# Altium schematic sheet BUS.SchDoc
size A4; SheetNumber: 3; SheetTotal: 6
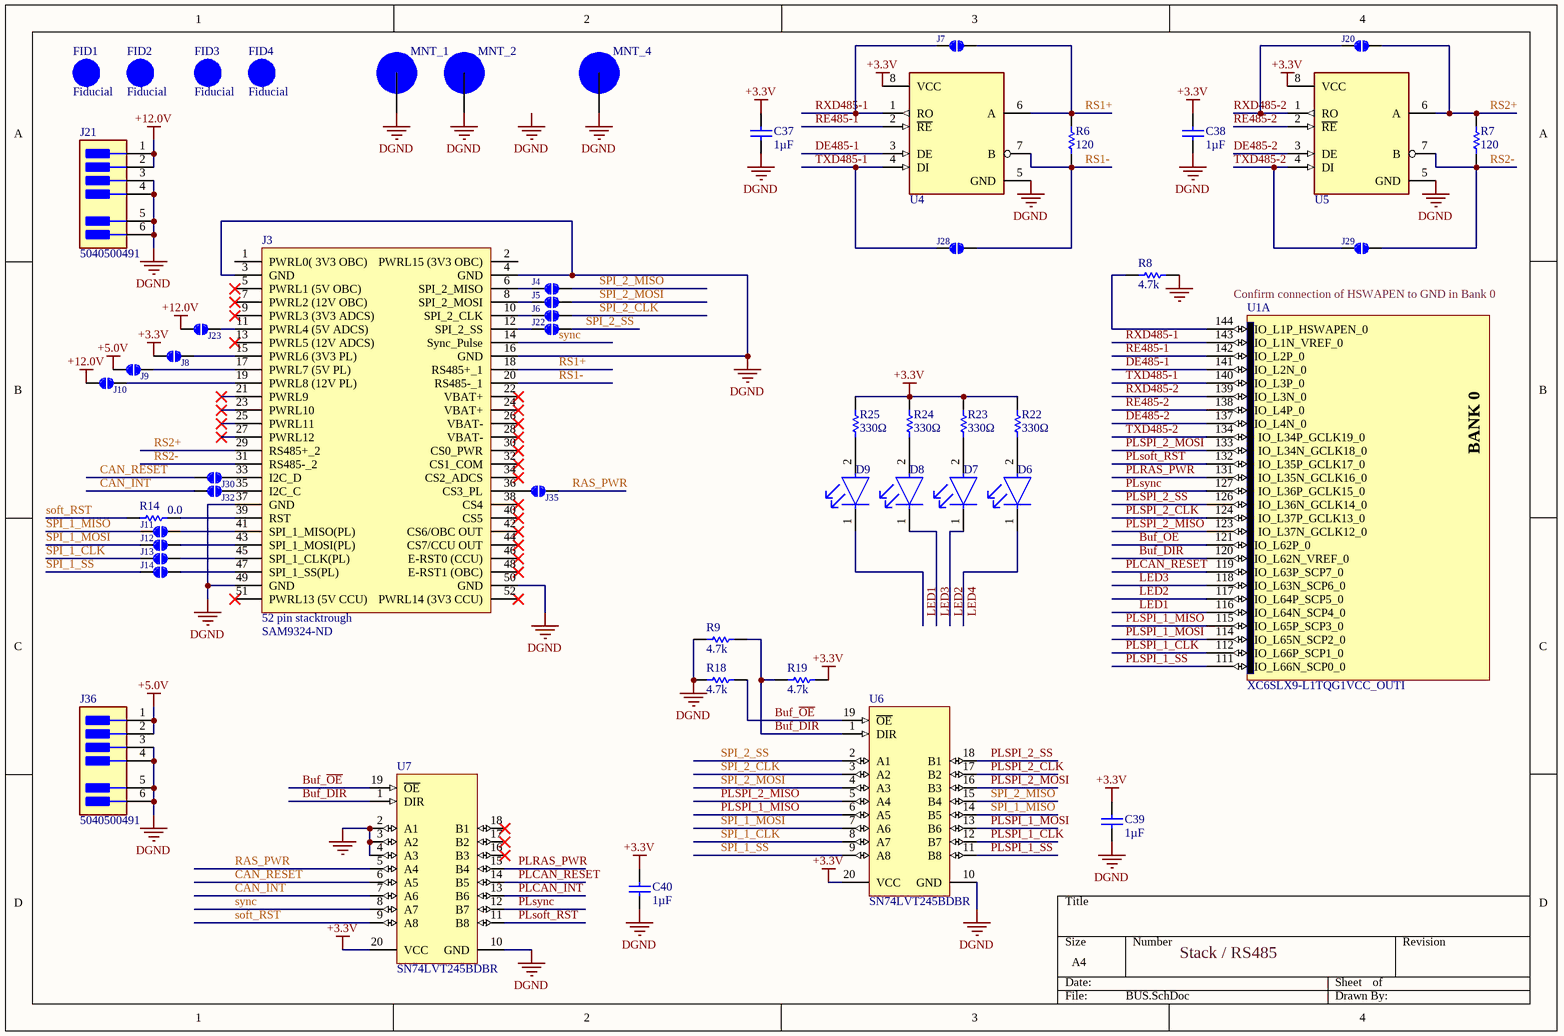
[diagram p0: BUS.SchDoc]

## Parts
C37  Capacitance: 1µF  [0603CAP]  (hidden comment: Cap_CER_1U_10V_0603)
C38  Capacitance: 1µF  [0603CAP]  (hidden comment: Cap_CER_1U_10V_0603)
C39  Capacitance: 1µF  [0603CAP]  (hidden comment: Cap_CER_1U_10V_0603)
C40  Capacitance: 1µF  [0603CAP]  (hidden comment: Cap_CER_1U_10V_0603)
D6  LED RED CLEAR 2SMD  [ROHM_SML-21_MFG]  (value not drawn)
D7  LED RED CLEAR 2SMD  [ROHM_SML-21_MFG]  (value not drawn)
D8  LED RED CLEAR 2SMD  [ROHM_SML-21_MFG]  (value not drawn)
D9  LED RED CLEAR 2SMD  [ROHM_SML-21_MFG]  (value not drawn)
FID1  Fiducial  [FID]  (no BOM)
FID2  Fiducial  [FID]  (no BOM)
FID3  Fiducial  [FID]  (no BOM)
FID4  Fiducial  [FID]  (no BOM)
J3  52 pin stacktrough  Supplier Part Number 1: SAM9324-ND  [StackThrough52]
J4  JUMPER  [SJMP]  (value not drawn)
J5  JUMPER  [SJMP]  (value not drawn)
J6  JUMPER  [SJMP]  (value not drawn)
J7  JUMPER  [SJMP]  (value not drawn)
J8  JUMPER  [SJMP]  (value not drawn)
J9  JUMPER  [SJMP]  (value not drawn)
J10  JUMPER  [SJMP]  (value not drawn)
J11  JUMPER  [SJMP]  (value not drawn)
J12  JUMPER  [SJMP]  (value not drawn)
J13  JUMPER  [SJMP]  (value not drawn)
J14  JUMPER  [SJMP]  (value not drawn)
J20  JUMPER  [SJMP]  (value not drawn)
J21  5040500491  [MOLEX_5040500491]
J22  JUMPER  [SJMP]  (value not drawn)
J23  JUMPER  [SJMP]  (value not drawn)
J28  JUMPER  [SJMP]  (value not drawn)
J29  JUMPER  [SJMP]  (value not drawn)
J30  JUMPER  [SJMP]  (value not drawn)
J32  JUMPER  [SJMP]  (value not drawn)
J35  JUMPER  [SJMP]  (value not drawn)
J36  5040500491  [MOLEX_5040500491]
MNT_1  Mount Hole  [Mount_Hole]  (value not drawn)  (no BOM)
MNT_2  Mount Hole  [Mount_Hole]  (value not drawn)  (no BOM)
MNT_4  Mount Hole  [Mount_Hole]  (value not drawn)  (no BOM)
R6  Resistance (Ohms): 120  [0603RES]  (hidden comment: RES_120_0.25W_0603)
R7  Resistance (Ohms): 120  [0603RES]  (hidden comment: RES_120_0.25W_0603)
R8  Resistance (Ohms): 4.7k  [0603RES]  (hidden comment: RES_4.7K_0.1W_0603)
R9  Resistance (Ohms): 4.7k  [0603RES]  (hidden comment: RES_4.7K_0.1W_0603)
R14  Resistance (Ohms): 0.0  [0603RES]  (hidden comment: RES_0_0.1W_0603)
R18  Resistance (Ohms): 4.7k  [0603RES]  (hidden comment: RES_4.7K_0.1W_0603)
R19  Resistance (Ohms): 4.7k  [0603RES]  (hidden comment: RES_4.7K_0.1W_0603)
R22  Resistance: 330Ω  [0603]  (hidden comment: RES_330 Ohm_0603)
R23  Resistance: 330Ω  [0603]  (hidden comment: RES_330 Ohm_0603)
R24  Resistance: 330Ω  [0603]  (hidden comment: RES_330 Ohm_0603)
R25  Resistance: 330Ω  [0603]  (hidden comment: RES_330 Ohm_0603)
U1  XC6SLX9-L1TQG1VCC_OUTI  [TQG144_M]  (part A of 7)
U4  ADM3493ARZ  [Soic8_IPCA]  (value not drawn)
U5  ADM3493ARZ  [Soic8_IPCA]  (value not drawn)
U6  SN74LVT245BDBR  [DB0020A_M]
U7  SN74LVT245BDBR  [DB0020A_M]

## Nets
+3.3V: C37.2 C38.2 C39.2 C40.2 J8.1 R19.1 R22.2 R23.2 R24.2 R25.2 U4.8(VCC) U5.8(VCC) U6.20(VCC) U7.20(VCC)
+5.0V: J9.1 J36.1 J36.2
+12.0V: J10.1 J21.1 J21.2 J23.1
DGND: C37.1 C38.1 C39.1 C40.1 J3.3(GND) J3.4(GND) J3.16(GND) J3.37(GND) J3.49(GND) J3.50(GND) J21.3 J21.4 J21.5 J21.6 J36.3 J36.4 J36.5 J36.6 MNT_1.1 MNT_2.1 MNT_4.1 R8.2 R9.2 R18.2 U4.5(GND) U5.5(GND) U6.10(GND) U7.2(A1) U7.3(A2) U7.4(A3) U7.10(GND)
Buf_DIR: R9.1 R19.2 U1.120(IO_L62N_VREF_0) U6.1(DIR) U7.1(DIR)
Buf_~{OE}: R18.1 U1.121(IO_L62P_0) U6.19(~{OE}) U7.19(~{OE})
CAN_INT: J32.1 U7.7(A6)
CAN_RESET: J30.1 U7.6(A5)
DE485-1: U1.141(IO_L2N_0) U4.3(DE)
DE485-2: U1.137(IO_L4N_0) U5.3(DE)
LED1: D9.1(C) U1.116(IO_L64N_SCP4_0)
LED2: D7.1(C) U1.117(IO_L64P_SCP5_0)
LED3: D8.1(C) U1.118(IO_L63N_SCP6_0)
LED4: D6.1(C)
PLCAN_INT: U7.13(B6)
PLCAN_RESET: U1.119(IO_L63P_SCP7_0) U7.14(B5)
PLRAS_PWR: U1.131(IO_L35N_GCLK16_0) U7.15(B4)
PLsoft_RST: U1.132(IO_L35P_GCLK17_0) U7.11(B8)
PLSPI_1_CLK: U1.112(IO_L66P_SCP1_0) U6.12(B7)
PLSPI_1_MISO: U1.115(IO_L65P_SCP3_0) U6.6(A5)
PLSPI_1_MOSI: U1.114(IO_L65N_SCP2_0) U6.13(B6)
PLSPI_1_SS: U1.111(IO_L66N_SCP0_0) U6.11(B8)
PLSPI_2_CLK: U1.124(IO_L37P_GCLK13_0) U6.17(B2)
PLSPI_2_MISO: U1.123(IO_L37N_GCLK12_0) U6.5(A4)
PLSPI_2_MOSI: U1.133(IO_L34N_GCLK18_0) U6.16(B3)
PLSPI_2_SS: U1.126(IO_L36N_GCLK14_0) U6.18(B1)
PLsync: U1.127(IO_L36P_GCLK15_0) U7.12(B7)
~{RE}485-1: U1.142(IO_L2P_0) U4.2(~{RE})
~{RE}485-2: U1.138(IO_L4P_0) U5.2(~{RE})
RAS_PWR: J35.2 U7.5(A4)
RS1+: J3.18(RS485+_1) J7.2 R6.2 U4.6(A)
RS1-: J3.20(RS485-_1) J28.2 R6.1 U4.7(B)
RS2+: J3.29(RS485+_2) J20.2 R7.2 U5.6(A)
RS2-: J3.31(RS485-_2) J29.2 R7.1 U5.7(B)
RXD485-1: J7.1 U1.143(IO_L1N_VREF_0) U4.1(RO)
RXD485-2: J20.1 U1.139(IO_L3N_0) U5.1(RO)
soft_RST: R14.1 U7.9(A8)
SPI_1_CLK: J13.1 U6.8(A7)
SPI_1_MISO: J11.1 U6.14(B5)
SPI_1_MOSI: J12.1 U6.7(A6)
SPI_1_SS: J14.1 U6.9(A8)
SPI_2_CLK: J6.2 U6.3(A2)
SPI_2_MISO: J4.2 U6.15(B4)
SPI_2_MOSI: J5.2 U6.4(A3)
SPI_2_SS: J22.2 U6.2(A1)
sync: J3.14(Sync_Pulse) U7.8(A7)
TXD485-1: J28.1 U1.140(IO_L3P_0) U4.4(DI)
TXD485-2: J29.1 U1.134(IO_L34P_GCLK19_0) U5.4(DI)
NetD6_2: D6.2(A) R22.1
NetD7_2: D7.2(A) R23.1
NetD8_2: D8.2(A) R24.1
NetD9_2: D9.2(A) R25.1
NetJ3_6: J3.6(SPI_2_MISO) J4.1
NetJ3_8: J3.8(SPI_2_MOSI) J5.1
NetJ3_10: J3.10(SPI_2_CLK) J6.1
NetJ3_11: J3.11(PWRL4_(5V_ADCS)) J23.2
NetJ3_12: J3.12(SPI_2_SS) J22.1
NetJ3_15: J3.15(PWRL6_(3V3_PL)) J8.2
NetJ3_17: J3.17(PWRL7_(5V_PL)) J9.2
NetJ3_19: J3.19(PWRL8_(12V_PL)) J10.2
NetJ3_33: J3.33(I2C_D) J30.2
NetJ3_35: J3.35(I2C_C) J32.2
NetJ3_36: J3.36(CS3_PL) J35.1
NetJ3_39: J3.39(RST) R14.2
NetJ3_41: J3.41(SPI_1_MISO(PL)) J11.2
NetJ3_43: J3.43(SPI_1_MOSI(PL)) J12.2
NetJ3_45: J3.45(SPI_1_CLK(PL)) J13.2
NetJ3_47: J3.47(SPI_1_SS(PL)) J14.2
NetR8_1: R8.1 U1.144(IO_L1P_HSWAPEN_0)

Not connected (* = marked no-connect by the designer): J3 1(PWRL0(_3V3_OBC)) 2(PWRL15_(3V3_OBC)) 5(PWRL1_(5V_OBC))* 7(PWRL2_(12V_OBC))* 9(PWRL3_(3V3_ADCS))* 13(PWRL5_(12V_ADCS))* 21(PWRL9)* 22(VBAT+)* 23(PWRL10)* 24(VBAT+)* 25(PWRL11)* 26(VBAT-)* 27(PWRL12)* 28(VBAT-)* 30(CS0_PWR)* 32(CS1_COM)* 34(CS2_ADCS)* 38(CS4)* 40(CS5)* 42(CS6/OBC_OUT)* 44(CS7/CCU_OUT)* 46(E-RST0_(CCU))* 48(E-RST1_(OBC))* 51(PWRL13_(5V_CCU))* 52(PWRL14_(3V3_CCU))*; U7 16(B3)* 17(B2)* 18(B1)*

## Notes on the sheet
- Confirm connection of HSWAPEN to GND in Bank 0
- Stack / RS485
- Labels drawn without touching a wire or pin: DGND
- (in symbol XC6SLX9-L1TQG144I, part A) BANK 0

## Library data of the parts
C37-C40 = Cap_CER_1U_10V_0603: Capacitor; Manufacturer: Taiyo Yuden; Manufacturer Part Number: LMK107B7105KA-T; Tolerance: ±10%; Voltage - Rated: 10V; Temperature Coefficient: X7R; Supplier 1: Digi-Key; RoHS: RoHS Compliant; Category: Capacitors; Stock 1: 600713; Pricing 1: 1=0.1, 10=0.042, 25=0.0308, 50=0.023, 100=0.0188, 250=0.01576, 500=0.01344, 1000=0.01056 (USD); Packaging: Cut Tape (CT); Part Status: Active; Operating Temperature: -55°C ~ 125°C; Features: -; Ratings: -; Applications: General Purpose; Mounting Type: Surface Mount, MLCC; Package / Case: 0603 (1608 Metric); Size / Dimension: 0.063" L x 0.031" W (1.60mm x 0.80mm); Height - Seated (Max): -; Thickness (Max): 0.035" (0.90mm); Lead Spacing: -; Lead Style: -; ComponentLink1URL: http://ds.yuden.co.jp/TYCOMPAS/ut/detail.do?productNo=LMK107B7105KA-T&fileName=LMK107B7105KA-T_SS&mode=specSheetDownload; ComponentLink1Description: http://ds.yuden.co.jp/TYCOMPAS/ut/detail.do?productNo=LMK107B7105KA-T&fileName=LMK107B7105KA-T_SS&mode=specSheetDownload; Supplier Part Number 1: 587-1242-1-ND
D6-D9 = APT2012LSECK/J3-PRV: Red 625nm LED Indication - Discrete 1.8V 0805 (2012 Metric); Manufacturer: Kingbright; Lens Color: Colorless; Luminous Intensity: 40mcd; Test Current: 2mA; Viewing Angle: 120°; Supplier 1: Digi-Key; Manufacturer Part Number: APT2012LSECK/J3-PRV; RoHS: Yes; Category: LEDs; Stock 1: 47256; Pricing 1: 1=0.68000, 10=0.41600, 100=0.23890, 1000=0.18698 (USD); Mount: Surface Mount; Case/Package: 0805; Color: Red; Case Code (Metric): 2012; Case Code (Imperial): 0805; Packaging: Tape and Reel; Lens Transparency: Clear; Dominant Wavelength: 625nm; Forward Voltage: 1.8V; Length: 2mm; Width: 1.25mm; Height: 0.75mm; RoHS Compliant: Yes; ComponentLink1URL: http://www.mouser.com/ds/2/216/APT2012LSECK-J3-PRV-535674.pdf?src-supplier=Mouser; ComponentLink1Description: http://www.mouser.com/ds/2/216/APT2012LSECK-J3-PRV-535674.pdf?src-supplier=Mouser; ComponentLink2URL: http://www.kingbrightusa.com/images/catalog/SPEC/APT2012LSECK-J3-PRV.pdf?src-supplier=Digi-Key; ComponentLink2Description: http://www.kingbrightusa.com/images/catalog/SPEC/APT2012LSECK-J3-PRV.pdf?src-supplier=Digi-Key; Supplier Part Number 1: 754-1935-1-ND
J3 = SPNEX_BUS: Conn Elevated Socket SKT 52 POS 2.54mm Solder ST Top Entry Thru-Hole Tube; Manufacturer: Samtec; Manufacturer Part Number: ESQ-126-38-G-D; Number of Contacts: 52; Gender: Female; Supplier 1: Digi-Key; RoHS: Yes; Category: Headers and Wire Housings; Stock 1: 81; Pricing 1: 1=17.62000, 16=15.26875, 80=12.58425, 440=11.49361 (USD); Mount: Through Hole; Contact Plating: Gold; Termination: Solder; Number of Rows: 2; Packaging: Bulk; Pitch: 2.54mm; Radiation Hardening: No; ComponentLink1URL: http://cloud.samtec.com/catalog_english/ESW_TH.PDF?src-supplier=Avnet; ComponentLink1Description: http://cloud.samtec.com/catalog_english/ESW_TH.PDF?src-supplier=Avnet; ComponentLink2URL: http://suddendocs.samtec.com/prints/esq-1xx-xx-x-x-xxx-xx-x-xx-mkt.pdf?src-supplier=Digi-Key; ComponentLink2Description: http://suddendocs.samtec.com/prints/esq-1xx-xx-x-x-xxx-xx-x-xx-mkt.pdf?src-supplier=Digi-Key
J4-J14 J20 J22 J23 J28-J30 J32 J35 = JUMPER: OPTION SELECTION PAD; Supplier 1: Digi-Key
J21 J36 = 5040500491: Connector Header Surface Mount, Right Angle 4 position 0.059" (1.50mm); Manufacturer: Molex; Supplier 1: Digi-Key; Manufacturer Part Number: 5040500491; RoHS: Yes; Category: Headers and Wire Housings; Stock 1: 197190; Pricing 1: 1=0.78000, 10=0.64700, 100=0.53880 (USD); ComponentLink1URL: https://datasheet.ciiva.com/48768/0532610471-pcb-headers-48768287.pdf?src-supplier=Avnet; ComponentLink1Description: https://datasheet.ciiva.com/48768/0532610471-pcb-headers-48768287.pdf?src-supplier=Avnet; Supplier Part Number 1: WM10137CT-ND
MNT_1 MNT_2 MNT_4 = MNT_Hole
R6 R7 = RES_120_0.25W_0603: RES SMD 120 OHM 5% 1/4W 0603; Manufacturer: Rohm Semiconductor; Manufacturer Part Number: ESR03EZPJ121; Power (Watts): 0.25W, 1/4W; Temperature Coefficient: ±200ppm/°C; Supplier 1: Digi-Key; RoHS: RoHS Compliant; Category: Resistors; Stock 1: 32826; Pricing 1: 1=0.1, 10=0.079, 25=0.0544, 50=0.0424, 100=0.0303, 250=0.0236, 500=0.01876, 1000=0.01331 (USD); Packaging: Digi-Reel®; Part Status: Active; Tolerance: ±5%; Composition: Thick Film; Features: Automotive AEC-Q200, Pulse Withstanding; Operating Temperature: -55°C ~ 155°C; Package / Case: 0603 (1608 Metric); Supplier Device Package: 0603; Size / Dimension: 0.063" L x 0.031" W (1.60mm x 0.80mm); Height - Seated (Max): 0.022" (0.55mm); Number of Terminations: 2; Failure Rate: -; ComponentLink1URL: http://rohmfs.rohm.com/en/products/databook/datasheet/passive/resistor/chip_resistor/esr.pdf; ComponentLink1Description: http://rohmfs.rohm.com/en/products/databook/datasheet/passive/resistor/chip_resistor/esr.pdf; Supplier Part Number 1: RHM120DDKR-ND
R8 R9 R18 R19 = RES_4.7K_0.1W_0603: Resistor; Manufacturer: Stackpole Electronics Inc.; Manufacturer Part Number: RMCF0603JT4K70; Tolerance: ±5%; Power (Watts): 0.1W, 1/10W; Temperature Coefficient: ±200ppm/°C; Supplier 1: Digi-Key; RoHS: RoHS Compliant; Category: Resistors; Stock 1: 86000; Pricing 1: 1=0.1, 10=0.012, 25=0.0088, 50=0.0066, 100=0.0049, 250=0.00372, 500=0.00298, 1000=0.0022 (USD); Packaging: Cut Tape (CT); Part Status: Active; Composition: Thick Film; Features: Automotive AEC-Q200; Operating Temperature: -55°C ~ 155°C; Package / Case: 0603 (1608 Metric); Supplier Device Package: 0603; Size / Dimension: 0.061" L x 0.031" W (1.55mm x 0.80mm); Height - Seated (Max): 0.022" (0.55mm); Number of Terminations: 2; Failure Rate: -; ComponentLink1URL: https://www.seielect.com/Catalog/SEI-RMCF_RMCP.pdf; ComponentLink1Description: https://www.seielect.com/Catalog/SEI-RMCF_RMCP.pdf; Supplier Part Number 1: RMCF0603JT4K70CT-ND
R14 = RES_0_0.1W_0603: Resistor; Manufacturer: Samsung Electro-Mechanics America, Inc.; Manufacturer Part Number: RC1608J000CS; Tolerance: Jumper; Power (Watts): 0.1W, 1/10W; Supplier 1: Digi-Key; RoHS: RoHS Compliant; Category: Resistors; Stock 1: 498586; Pricing 1: 1=0.1, 10=0.017, 25=0.0124, 50=0.0094, 100=0.0069, 250=0.00528, 500=0.00422, 1000=0.0031 (USD); Packaging: Cut Tape (CT); Part Status: Active; Composition: Thick Film; Features: Moisture Resistant; Temperature Coefficient: -; Operating Temperature: -55°C ~ 155°C; Package / Case: 0603 (1608 Metric); Supplier Device Package: 0603; Size / Dimension: 0.063" L x 0.031" W (1.60mm x 0.80mm); Height - Seated (Max): 0.022" (0.55mm); Number of Terminations: 2; Failure Rate: -; ComponentLink1URL: http://media.digikey.com/pdf/Data%20Sheets/Samsung%20PDFs/RC_Series_ds.pdf; ComponentLink1Description: http://media.digikey.com/pdf/Data%20Sheets/Samsung%20PDFs/RC_Series_ds.pdf; Supplier Part Number 1: 1276-3510-1-ND
R22-R25 = RES_330 Ohm_0603: Res Thick Film 0603 330 Ohm 5% 0.1W(1/10W) +/-200ppm/ßC Pad SMD Automotive T/R; Manufacturer: Panasonic; Manufacturer Part Number: ERJ-3GEYJ331V; Power Rating: 100mW; Voltage Rating: 75V; Temperature Coefficient: 200ppm/°C; Voltage Rating (DC): 50V; Supplier 1: Digi-Key; RoHS: Yes; Stock 1: 2750454; Pricing 1: 1 = 0.10000, 10 = 0.05400, 100 = 0.02190, 1000 = 0.00985, 2500 = 0.00855 (USD); Mount: Surface Mount; Case/Package: 0603; Weight: 7.1E-05oz; Case Code (Metric): 1608; Case Code (Imperial): 0603; Contact Plating: Tin; Min Operating Temperature: -55°C; Max Operating Temperature: 155°C; Tolerance: 5%; Packaging: Tape and Reel; Package Quantity: 1; Composition: Thick Film; Number of Terminations: 2; Termination: SMD/SMT; Military Standard: Not; Max Power Dissipation: 100mW; Features: Automotive AEC-Q200; Length: 1.6mm; Height: 0.45mm; Width: 0.031inch; Depth: 0.8mm; Radiation Hardening: No; REACH SVHC: No SVHC; Lead Free: Lead Free; ComponentLink1URL: https://datasheet.ciiva.com/34303/1988727-34303616.pdf?src-supplier=Jameco; ComponentLink1Description: https://datasheet.ciiva.com/34303/1988727-34303616.pdf?src-supplier=Jameco; ComponentLink2URL: https://datasheet.ciiva.com/11821/0900766b80f806dd-11821444.pdf?src-supplier=RSComponents; ComponentLink2Description: https://datasheet.ciiva.com/11821/0900766b80f806dd-11821444.pdf?src-supplier=RSComponents; ComponentLink3URL: https://datasheet.ciiva.com/9117/aoa0000ce1-9117173.pdf?src-supplier=Avnet; ComponentLink3Description: https://datasheet.ciiva.com/9117/aoa0000ce1-9117173.pdf?src-supplier=Avnet; ComponentLink4URL: https://datasheet.ciiva.com/16767/70255313-16767749.pdf?src-supplier=Allied+Electronics; ComponentLink4Description: https://datasheet.ciiva.com/16767/70255313-16767749.pdf?src-supplier=Allied+Electronics; ComponentLink5URL: https://datasheet.ciiva.com/15159/getdatasheetpartid-29203-15159270.pdf?src-supplier=Verical; ComponentLink5Description: https://datasheet.ciiva.com/15159/getdatasheetpartid-29203-15159270.pdf?src-supplier=Verical; ComponentLink6URL: https://datasheet.ciiva.com/28673/1678796-28673994.pdf?src-supplier=Element14; ComponentLink6Description: https://datasheet.ciiva.com/28673/1678796-28673994.pdf?src-supplier=Element14; ComponentLink7URL: https://datasheet.ciiva.com/6138/1500035-6138716.pdf?src-supplier=Farnell; ComponentLink7Description: https://datasheet.ciiva.com/6138/1500035-6138716.pdf?src-supplier=Farnell; ComponentLink8URL: https://datasheet.ciiva.com/46381/1500035-46381164.pdf?src-supplier=Element14; ComponentLink8Description: https://datasheet.ciiva.com/46381/1500035-46381164.pdf?src-supplier=Element14; ComponentLink9URL: https://datasheet.ciiva.com/16449/aoa0000ce1-16449005.pdf?src-supplier=Future+Electronics; ComponentLink9Description: https://datasheet.ciiva.com/16449/aoa0000ce1-16449005.pdf?src-supplier=Future+Electronics; Supplier Part Number 1: P330GCT-ND
U1 = XC6SLX9-L1TQG144I: Spartan-6 LX 1.0V FPGA, 102 User I/Os, 144-Pin TQFP (0.5mm Pitch), Low Power Version, Industrial Grade, Pb-Free; Published: 17-Nov-2009; DatasheetVersion: ver1.6, Nov-2010; PackageVersion: ver1.2, Jun-2004; PackageReference: TQG144; Publisher: Altium Limited; PackageDescription: 144-Pin Thin Quad Flat Pack (TQG144) - Pb-Free; Code_JEDEC: MS-026-BFB; ComponentLink1Description: Manufacturer Link; ComponentLink1URL: http://www.xilinx.com; ComponentLink2Description: Spartan-6 Datasheet; ComponentLink2URL: http://www.xilinx.com/support/documentation/data_sheets/ds160.pdf; ComponentLink3Description: Spartan-6 Documents; ComponentLink3URL: http://www.xilinx.com/support/documentation/spartan-6.htm; ComponentLink4Description: Xilinx.com Home; ComponentLink4URL: http://www.xilinx.com; Supplier 1: Digi-Key; Supplier Part Number 1: 122-1779-ND
U4 U5 = ADM3493ARZ: Manufacturer: Analog Devices; Simplex/Duplex: Half Duplex; Receiver Hysteresis: 50mV; Logic Function: Transceiver; Number of Drivers: 1; Operating Supply Current: 2.2mA; ESD Protection: No; Data Rate: 250Kbps; Operating Supply Voltage: 3.3V; Min Supply Voltage: 3V; Max Supply Voltage: 3.6V; Interface: RS-422,RS-485; Supplier 1: Digi-Key; Manufacturer Part Number: ADM3493ARZ; RoHS: Yes; Stock 1: 35; Pricing 1: 1 = 2.92000, 10 = 2.62400, 25 = 2.47520, 100 = 1.98000, 250 = 1.73252, 500 = 1.68300, 1000 = 1.33650, 2500 = 1.31670 (USD); Mount: Surface Mount; Case/Package: SOIC; Number of Pins: 8; Contact Plating: Tin,Matte; Weight: 0.019048oz; Min Operating Temperature: -40°C; Max Operating Temperature: 85°C; Package Quantity: 98; Number of Transceivers: 1; Max Supply Current: 2.2mA; Packaging: Rail/Tube; Number of Receivers: 1; Number of Transmitters: 1; Nominal Supply Current: 2.2mA; Length: 5mm; Width: 4mm; Height: 1.5mm; Radiation Hardening: No; Lead Free: Contains Lead; REACH SVHC: No SVHC; ComponentLink1URL: https://datasheet.ciiva.com/3028/adm3493-3028992.pdf?src-supplier=Avnet; ComponentLink1Description: https://datasheet.ciiva.com/3028/adm3493-3028992.pdf?src-supplier=Avnet; ComponentLink2URL: https://datasheet.ciiva.com/1147/197012-1147564.pdf?src-supplier=Element14; ComponentLink2Description: https://datasheet.ciiva.com/1147/197012-1147564.pdf?src-supplier=Element14; ComponentLink3URL: https://datasheet.ciiva.com/1700/adm3493-1700154.pdf?src-supplier=Digi-Key; ComponentLink3Description: https://datasheet.ciiva.com/1700/adm3493-1700154.pdf?src-supplier=Digi-Key; ComponentLink4URL: https://datasheet.ciiva.com/15151/getdatasheetpartid-202037-15151690.pdf?src-supplier=Verical; ComponentLink4Description: https://datasheet.ciiva.com/15151/getdatasheetpartid-202037-15151690.pdf?src-supplier=Verical; ComponentLink5URL: https://datasheet.ciiva.com/48706/001248446-da-01-en-ic-txrx-rs-422-485-adm3493arz-soic-8-adi-48706090.pdf?src-supplier=Conrad; ComponentLink5Description: https://datasheet.ciiva.com/48706/001248446-da-01-en-ic-txrx-rs-422-485-adm3493arz-soic-8-adi-48706090.pdf?src-supplier=Conrad; Supplier Part Number 1: ADM3493ARZ-ND
U6 U7 = SN74LVT245BDBR: 3.3-V ABT Octal Bus Transceivers With 3-State Outputs, DB0020A, LARGE T&R; Manufacturer: Texas Instruments; Technology Family: LVT; VCC(Min)(V): 2.7; Input Type: TTL/CMOS; Output Type: LVTTL; F @ Nom Voltage(Max)(Mhz): 160; VCC(Max)(V): 3.6; ICC @ Nom Voltage(Max)(mA): 5; Output Drive (IOL/IOH)(Max)(mA): -32/64; Schmitt Trigger: No; Rating: Catalog; tpd @ Nom Voltage(Max)(ns): 3.5; Bits(#): 8; Voltage(Nom)(V): 3.3; Operating Temperature Range(C): -40 to 85; PartNumber: SN74LVT245BDBR; ComponentLink1Description: Manufacturer URL; ComponentLink2Description: Datasheet; DatasheetVersion: SCES004H; ComponentLink3URL: http://www.ti.com/lit/ml/mpds508/mpds508.pdf; ComponentLink1URL: http://www.ti.com/; Code_JEDEC: MO-150; ComponentLink2URL: http://www.ti.com/lit/ds/symlink/sn74lvt245b.pdf; PackageReference: DB0020A; ComponentLink3Description: Package Specification; Generic Part Number: SN74LVT245B; Supplier 1: Digi-Key; Supplier Part Number 1: 296-8650-1-ND